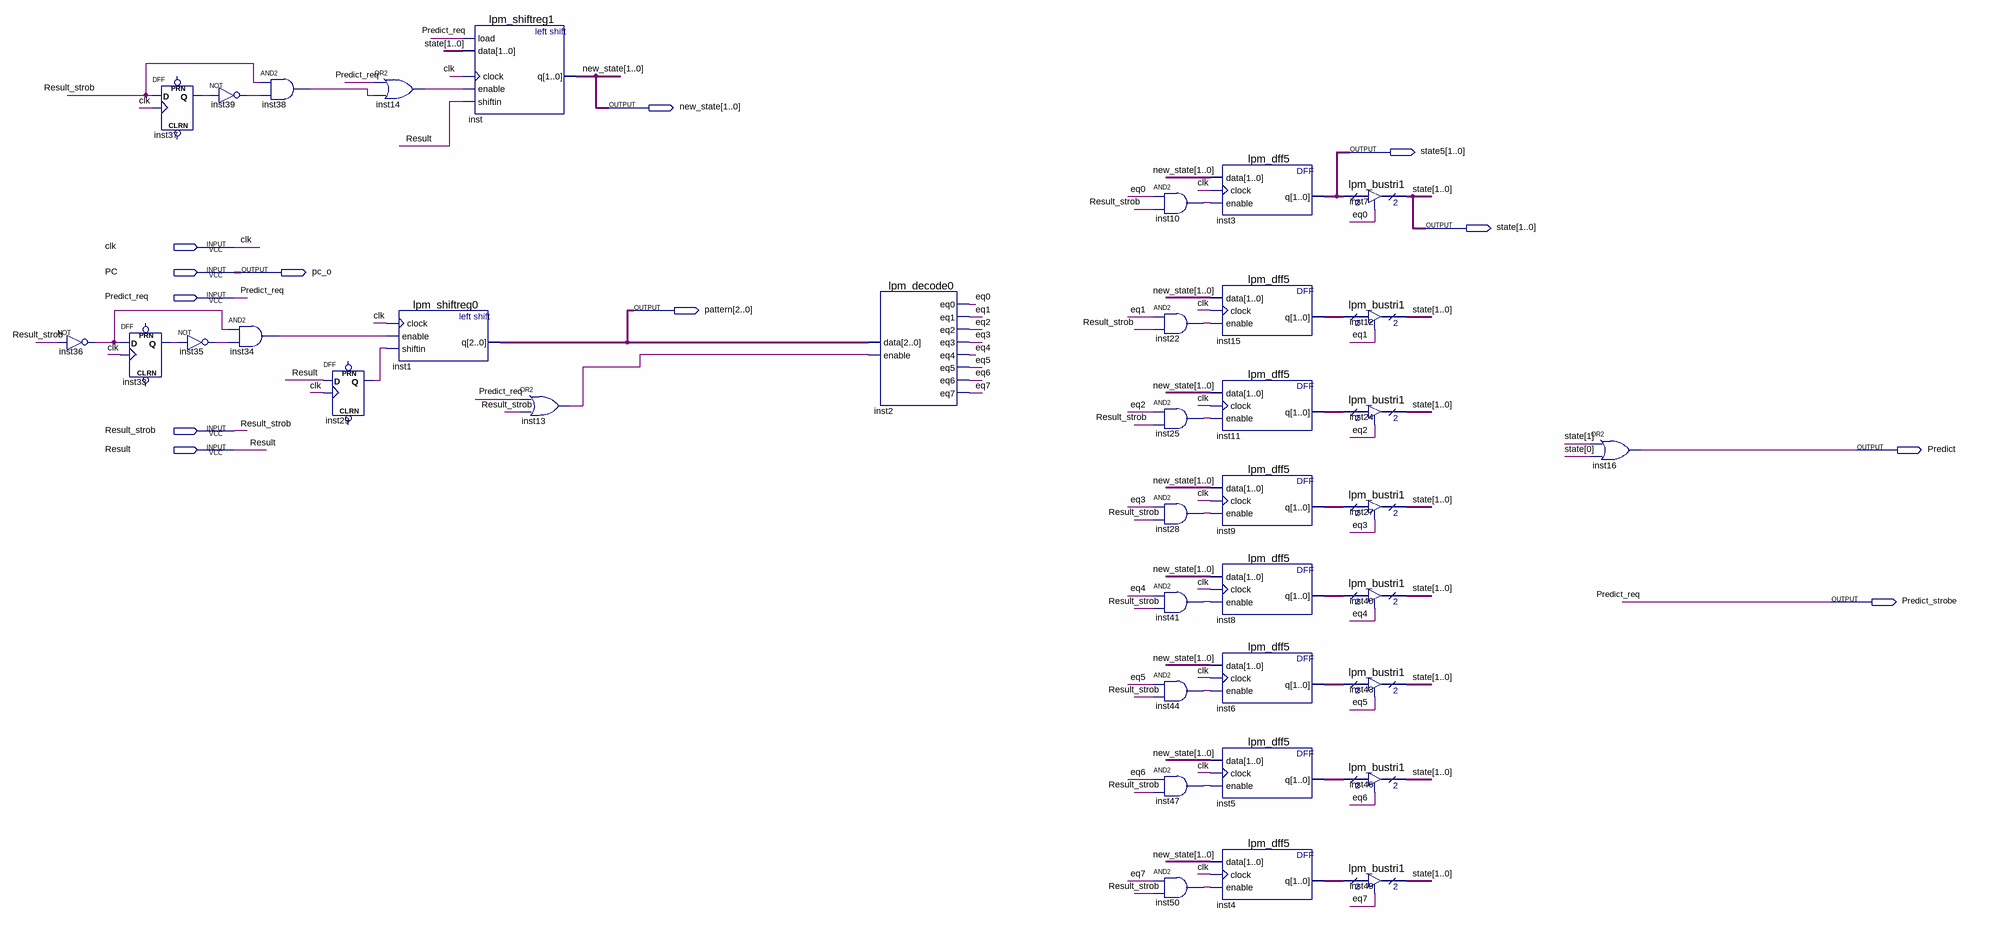
[diagram p0: schematic sheet]
// Quartus schematic predskaz.bdf as structural Verilog: 38 symbols, 12 pins
module predskaz (
  input  clk,
  input  PC,
  input  Predict_req,
  input  Result_strob,
  input  Result,
  output [1:0] new_state,
  output [1:0] state5,
  output [1:0] state,
  output pc_o,
  output [2:0] pattern,
  output Predict,
  output Predict_strobe
);

  wire eq0, eq1, eq2, eq3, eq4, eq5, eq6, eq7, inst10_out, inst13_out, inst14_out, inst22_out, inst25_out,
       inst28_out, inst29_q, inst33_q, inst34_out, inst35_out, inst36_out, inst37_q, inst38_out, inst39_out,
       inst41_out, inst44_out, inst47_out, inst50_out;
  wire [1:0] inst4_q, inst5_q, inst6_q, inst8_q, inst9_q, inst11_q, inst15_q;

  not inst36 (inst36_out, Result_strob);
  DFF inst33 (.CLK(clk), .D(inst36_out), .Q(inst33_q));  // open: CLRN, PRN
  DFF inst37 (.CLK(clk), .D(Result_strob), .Q(inst37_q));  // open: CLRN, PRN
  not inst35 (inst35_out, inst33_q);
  not inst39 (inst39_out, inst37_q);
  and inst34 (inst34_out, inst36_out, inst35_out);
  and inst38 (inst38_out, Result_strob, inst39_out);
  DFF inst29 (.CLK(clk), .D(Result), .Q(inst29_q));  // open: CLRN, PRN
  or inst14 (inst14_out, Predict_req, inst38_out);
  lpm_shiftreg0 inst1 (.clock(clk), .enable(inst34_out), .shiftin(inst29_q), .q(pattern));
  lpm_shiftreg1 inst (
    .load(Predict_req), .data(state), .clock(clk), .enable(inst14_out), .shiftin(Result), .q(new_state));
  or inst13 (inst13_out, Predict_req, Result_strob);
  lpm_decode0 inst2 (
    .data(pattern), .enable(inst13_out), .eq0(eq0), .eq1(eq1), .eq2(eq2), .eq3(eq3), .eq4(eq4), .eq5(eq5),
    .eq6(eq6), .eq7(eq7));
  and inst10 (inst10_out, eq0, Result_strob);
  and inst22 (inst22_out, eq1, Result_strob);
  and inst25 (inst25_out, eq2, Result_strob);
  and inst28 (inst28_out, eq3, Result_strob);
  and inst41 (inst41_out, eq4, Result_strob);
  and inst44 (inst44_out, eq5, Result_strob);
  and inst47 (inst47_out, eq6, Result_strob);
  and inst50 (inst50_out, eq7, Result_strob);
  lpm_dff5 inst3 (.data(new_state), .clock(clk), .enable(inst10_out), .q(state5));
  lpm_dff5 inst15 (.data(new_state), .clock(clk), .enable(inst22_out), .q(inst15_q));
  lpm_dff5 inst11 (.data(new_state), .clock(clk), .enable(inst25_out), .q(inst11_q));
  lpm_dff5 inst9 (.data(new_state), .clock(clk), .enable(inst28_out), .q(inst9_q));
  lpm_dff5 inst8 (.data(new_state), .clock(clk), .enable(inst41_out), .q(inst8_q));
  lpm_dff5 inst6 (.data(new_state), .clock(clk), .enable(inst44_out), .q(inst6_q));
  lpm_dff5 inst5 (.data(new_state), .clock(clk), .enable(inst47_out), .q(inst5_q));
  lpm_dff5 inst4 (.data(new_state), .clock(clk), .enable(inst50_out), .q(inst4_q));
  lpm_bustri1 inst7 (.enabledt(eq0), .data(state5), .tridata(state));
  lpm_bustri1 inst12 (.enabledt(eq1), .data(inst15_q), .tridata(state));
  lpm_bustri1 inst24 (.enabledt(eq2), .data(inst11_q), .tridata(state));
  lpm_bustri1 inst27 (.enabledt(eq3), .data(inst9_q), .tridata(state));
  lpm_bustri1 inst40 (.enabledt(eq4), .data(inst8_q), .tridata(state));
  lpm_bustri1 inst43 (.enabledt(eq5), .data(inst6_q), .tridata(state));
  lpm_bustri1 inst46 (.enabledt(eq6), .data(inst5_q), .tridata(state));
  lpm_bustri1 inst49 (.enabledt(eq7), .data(inst4_q), .tridata(state));
  or inst16 (Predict, state[1], state[0]);

  assign pc_o = PC;
  assign Predict_strobe = Predict_req;
endmodule
